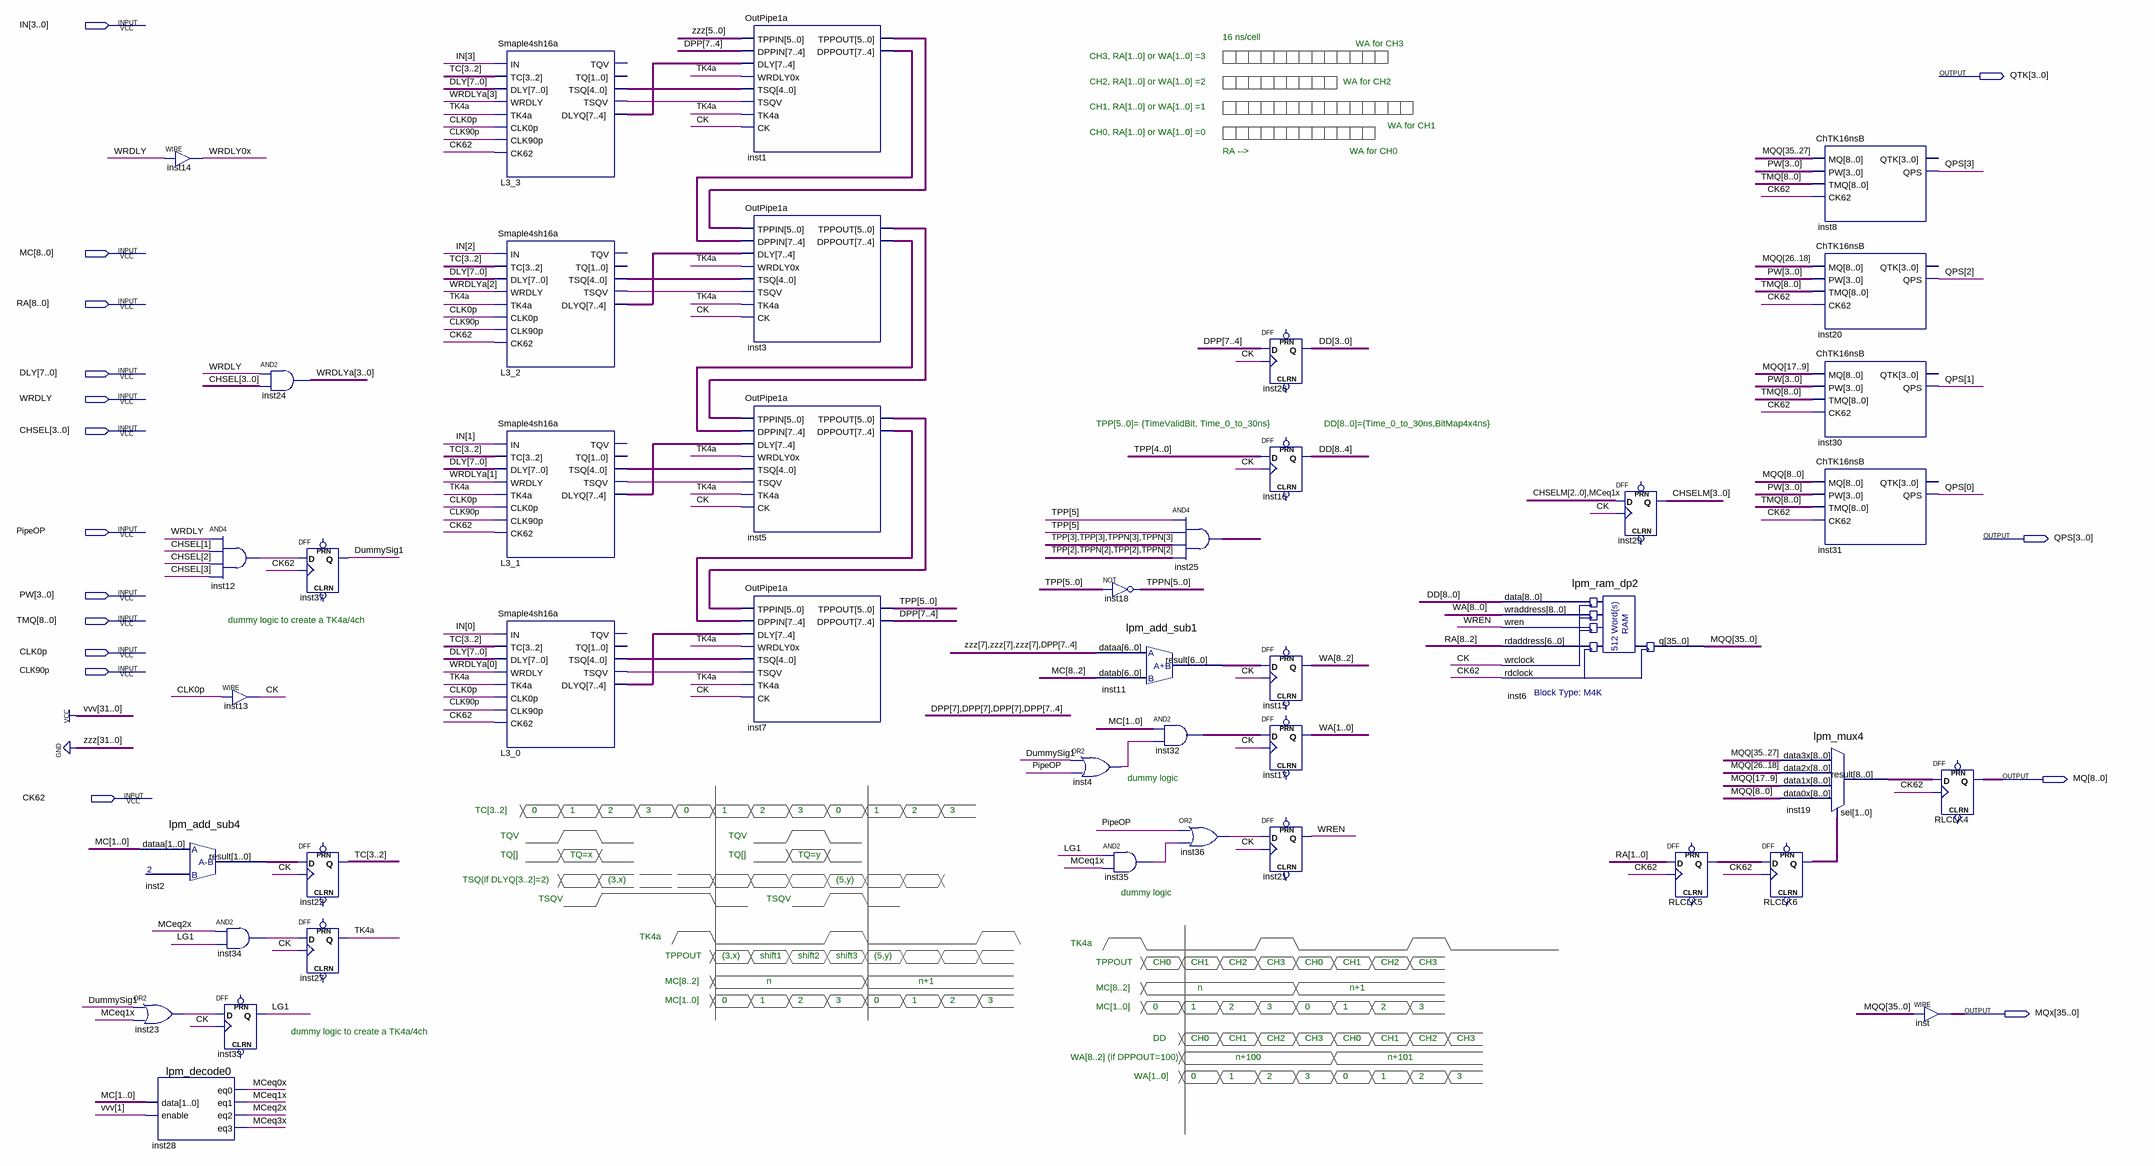
[diagram p0: schematic sheet]
// Quartus schematic GRP4ch.bdf as structural Verilog: 43 symbols, 16 pins
module GRP4ch (
  input  [3:0] IN,
  input  [8:0] MC,
  input  [8:0] RA,
  input  [7:0] DLY,
  input  WRDLY,
  input  [3:0] CHSEL,
  input  PipeOP,
  input  [3:0] PW,
  input  [8:0] TMQ,
  input  CLK0p,
  input  CLK90p,
  input  CK62,
  output [3:0] QTK,
  output [3:0] QPS,
  output [8:0] MQ,
  output [35:0] MQx
);

  wire CK, DummySig1, inst4_out, inst12_out, inst23_out, inst34_out, inst35_out, inst36_out, L3_0_tsqv,
       L3_1_tsqv, L3_2_tsqv, L3_3_tsqv, LG1, MCeq0x, MCeq1x, MCeq2x, MCeq3x, TK4a, WRDLY0x, WREN;
  wire [1:0] inst2_result, inst32_out, RLCLK5_q, RLCLK6_q;
  wire [3:0] CHSELM, inst1_dppout, inst3_dppout, inst5_dppout, inst25_out, L3_0_dlyq, L3_1_dlyq, L3_2_dlyq,
       L3_3_dlyq, WRDLYa;
  wire [3:2] TC;
  wire [4:0] L3_0_tsq, L3_1_tsq, L3_2_tsq, L3_3_tsq;
  wire [5:0] inst1_tppout, inst3_tppout, inst5_tppout, TPP, TPPN;
  wire [6:0] inst11_result;
  wire [7:4] DPP;
  wire [8:0] DD, inst19_result, WA;
  wire [35:0] MQQ;

  or inst23 (inst23_out, DummySig1, MCeq1x);
  assign WRDLY0x = WRDLY;  // WIRE inst14
  lpm_add_sub4 inst2 (.dataa(MC[1:0]), .result(inst2_result));
  lpm_decode0 inst28 (.data(MC[1:0]), .enable(1'b1), .eq0(MCeq0x), .eq1(MCeq1x), .eq2(MCeq2x), .eq3(MCeq3x));
  and inst12 (inst12_out, WRDLY, CHSEL[1], CHSEL[2], CHSEL[3]);
  assign CK = CLK0p;  // WIRE inst13
  and inst34 (inst34_out, MCeq2x, LG1);
  DFF inst33 (.CLK(CK), .D(inst23_out), .Q(LG1));  // open: CLRN, PRN
  assign WRDLYa = {4{WRDLY}} & CHSEL;  // AND2 inst24, 4 bits wide
  DFF inst37 (.CLK(CK62), .D(inst12_out), .Q(DummySig1));  // open: CLRN, PRN
  DFF inst22[1:0] (.CLK(CK), .D(inst2_result), .Q(TC));  // open: CLRN, PRN
  DFF inst27 (.CLK(CK), .D(inst34_out), .Q(TK4a));  // open: CLRN, PRN
  Smaple4sh16a L3_3 (
    .IN(IN[3]), .TC(TC), .DLY(DLY), .WRDLY(WRDLYa[3]), .TK4a(TK4a), .CLK0p(CLK0p), .CLK90p(CLK90p),
    .CK62(CK62), .TSQ(L3_3_tsq), .TSQV(L3_3_tsqv), .DLYQ(L3_3_dlyq));  // open: TQV, TQ
  Smaple4sh16a L3_2 (
    .IN(IN[2]), .TC(TC), .DLY(DLY), .WRDLY(WRDLYa[2]), .TK4a(TK4a), .CLK0p(CLK0p), .CLK90p(CLK90p),
    .CK62(CK62), .TSQ(L3_2_tsq), .TSQV(L3_2_tsqv), .DLYQ(L3_2_dlyq));  // open: TQV, TQ
  Smaple4sh16a L3_1 (
    .IN(IN[1]), .TC(TC), .DLY(DLY), .WRDLY(WRDLYa[1]), .TK4a(TK4a), .CLK0p(CLK0p), .CLK90p(CLK90p),
    .CK62(CK62), .TSQ(L3_1_tsq), .TSQV(L3_1_tsqv), .DLYQ(L3_1_dlyq));  // open: TQV, TQ
  Smaple4sh16a L3_0 (
    .IN(IN[0]), .TC(TC), .DLY(DLY), .WRDLY(WRDLYa[0]), .TK4a(TK4a), .CLK0p(CLK0p), .CLK90p(CLK90p),
    .CK62(CK62), .TSQ(L3_0_tsq), .TSQV(L3_0_tsqv), .DLYQ(L3_0_dlyq));  // open: TQV, TQ
  OutPipe1a inst1 (
    .TPPIN({6{1'b0}}), .DPPIN(DPP), .DLY(L3_3_dlyq), .WRDLY0x(TK4a), .TSQ(L3_3_tsq), .TSQV(L3_3_tsqv),
    .TK4a(TK4a), .CK(CK), .TPPOUT(inst1_tppout), .DPPOUT(inst1_dppout));
  OutPipe1a inst3 (
    .TPPIN(inst1_tppout), .DPPIN(inst1_dppout), .DLY(L3_2_dlyq), .WRDLY0x(TK4a), .TSQ(L3_2_tsq),
    .TSQV(L3_2_tsqv), .TK4a(TK4a), .CK(CK), .TPPOUT(inst3_tppout), .DPPOUT(inst3_dppout));
  OutPipe1a inst5 (
    .TPPIN(inst3_tppout), .DPPIN(inst3_dppout), .DLY(L3_1_dlyq), .WRDLY0x(TK4a), .TSQ(L3_1_tsq),
    .TSQV(L3_1_tsqv), .TK4a(TK4a), .CK(CK), .TPPOUT(inst5_tppout), .DPPOUT(inst5_dppout));
  OutPipe1a inst7 (
    .TPPIN(inst5_tppout), .DPPIN(inst5_dppout), .DLY(L3_0_dlyq), .WRDLY0x(TK4a), .TSQ(L3_0_tsq),
    .TSQV(L3_0_tsqv), .TK4a(TK4a), .CK(CK), .TPPOUT(TPP), .DPPOUT(DPP));
  lpm_add_sub1 inst11 (.dataa({3'b000, DPP}), .datab(MC[8:2]), .result(inst11_result));
  or inst4 (inst4_out, DummySig1, PipeOP);
  assign TPPN = ~TPP;  // NOT inst18, 6 bits wide
  and inst35 (inst35_out, LG1, MCeq1x);
  assign inst25_out = {4{TPP[5]}} & {4{TPP[5]}} & {{2{TPP[3]}}, {2{TPPN[3]}}} & {TPP[2], TPPN[2], TPP[2], TPPN[2]};  // AND4 inst25, 4 bits wide
  assign inst32_out = MC[1:0] & {2{inst4_out}};  // AND2 inst32, 2 bits wide
  or inst36 (inst36_out, PipeOP, inst35_out);
  DFF inst26[3:0] (.CLK(CK), .D(DPP), .Q(DD[3:0]));  // open: CLRN, PRN
  DFF inst16[4:0] (.CLK(CK), .D(TPP[4:0]), .Q(DD[8:4]));  // open: CLRN, PRN
  DFF inst15[6:0] (.CLK(CK), .D(inst11_result), .Q(WA[8:2]));  // open: CLRN, PRN
  DFF inst17[1:0] (.CLK(CK), .D(inst32_out), .Q(WA[1:0]));  // open: CLRN, PRN
  DFF inst21 (.CLK(CK), .D(inst36_out), .Q(WREN));  // open: CLRN, PRN
  lpm_ram_dp2 inst6 (
    .data(DD), .wraddress(WA), .wren(WREN), .rdaddress(RA[8:2]), .wrclock(CK), .rdclock(CK62), .q(MQQ));
  DFF inst29[3:0] (.CLK(CK), .D({CHSELM[2:0], MCeq1x}), .Q(CHSELM));  // open: CLRN, PRN
  DFF RLCLK5[1:0] (.CLK(CK62), .D(RA[1:0]), .Q(RLCLK5_q));  // open: CLRN, PRN
  lpm_mux4 inst19 (
    .data3x(MQQ[35:27]), .data2x(MQQ[26:18]), .data1x(MQQ[17:9]), .data0x(MQQ[8:0]), .sel(RLCLK6_q),
    .result(inst19_result));
  DFF RLCLK6[1:0] (.CLK(CK62), .D(RLCLK5_q), .Q(RLCLK6_q));  // open: CLRN, PRN
  ChTK16nsB inst8 (.MQ(MQQ[35:27]), .PW(PW), .TMQ(TMQ), .CK62(CK62), .QPS(QPS[3]));  // open: QTK
  ChTK16nsB inst20 (.MQ(MQQ[26:18]), .PW(PW), .TMQ(TMQ), .CK62(CK62), .QPS(QPS[2]));  // open: QTK
  ChTK16nsB inst30 (.MQ(MQQ[17:9]), .PW(PW), .TMQ(TMQ), .CK62(CK62), .QPS(QPS[1]));  // open: QTK
  ChTK16nsB inst31 (.MQ(MQQ[8:0]), .PW(PW), .TMQ(TMQ), .CK62(CK62), .QPS(QPS[0]));  // open: QTK
  DFF RLCLK4[8:0] (.CLK(CK62), .D(inst19_result), .Q(MQ));  // open: CLRN, PRN
  assign MQx = MQQ;  // WIRE inst

  // Notes on the sheet:
  //   16 ns/cell
  //   WA for CH3
  //   CH3, RA[1..0] or WA[1..0] =3
  //   CH2, RA[1..0] or WA[1..0] =2
  //   WA for CH2
  //   CH1, RA[1..0] or WA[1..0] =1
  //   WA for CH1
  //   CH0, RA[1..0] or WA[1..0] =0
  //   RA -->
  //   WA for CH0
  //   TPP[5..0]= {TimeValidBit, Time_0_to_30ns}
  //   DD[8..0]={Time_0_to_30ns,BitMap4x4ns}
  //   dummy logic to create a TK4a/4ch
  //   dummy logic
  //   TC[3..2]
  //   0
  //   1
  //   2
  //   3
  //   0
  //   1
  //   2
  //   3
  //   0
  //   1
  //   2
  //   3
  //   TQV
  //   TQV
  //   TQ[]
  //   TQ=x
  //   TQ[]
  //   TQ=y
  //   TSQ(if DLYQ[3..2]=2)
  //   (3,x)
  //   (5,y)
  //   dummy logic
  //   TSQV
  //   TSQV
  //   TK4a
  //   TK4a
  //   TPPOUT
  //   (3,x)
  //   shift1
  //   shift2
  //   shift3
  //   (5,y)
  //   TPPOUT
  //   CH0
  //   CH1
  //   CH2
  //   CH3
  //   CH0
  //   CH1
  //   CH2
  //   CH3
  //   MC[8..2]
  //   n
  //   n+1
  //   MC[8..2]
  //   n
  //   n+1
  //   MC[1..0]
  //   0
  //   1
  //   2
  //   3
  //   0
  //   1
  //   2
  //   3
  //   MC[1..0]
  //   0
  //   1
  //   2
  //   3
  //   0
  //   1
  //   2
  //   3
  //   dummy logic to create a TK4a/4ch
  //   DD
  //   CH0
  //   CH1
  //   CH2
  //   CH3
  //   CH0
  //   CH1
  //   CH2
  //   CH3
  //   WA[8..2] (if DPPOUT=100)
  //   n+100
  //   n+101
  //   WA[1..0]
  //   0
  //   1
  //   2
  //   3
  //   0
  //   1
  //   2
  //   3
endmodule
